# EAGLE schematic CraneCon (EAGLE 9.0.0)
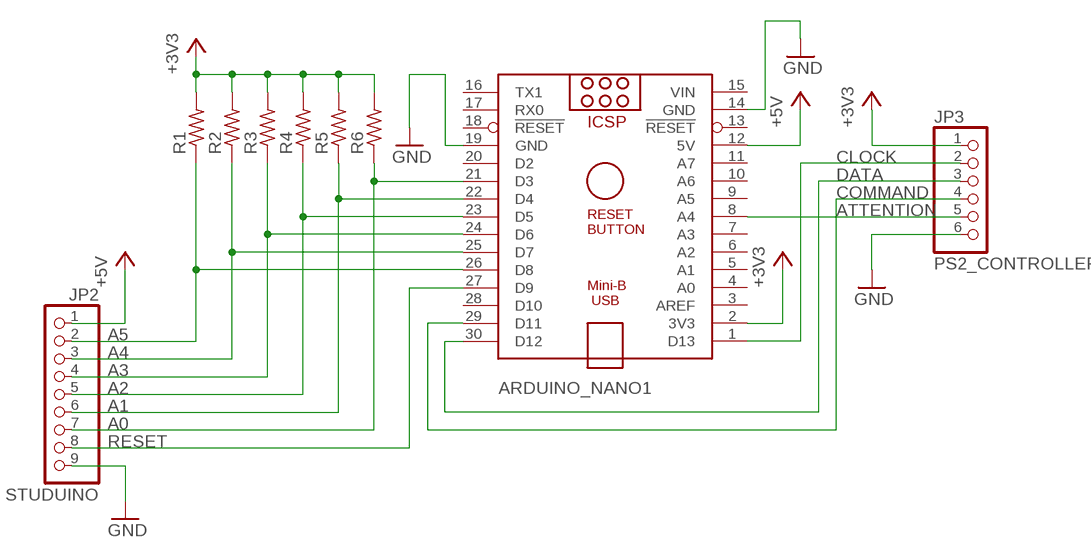
[diagram p0: schematic, sheet 1]

## Parts
ARDUINO_NANO1  ARDUINO_NANO  [ARDUINO_NANO]
JP2  STUDUINO  PINHD-1X9  [1X09]
JP3  PS2_CONTROLLER  PINHD-1X6  [1X06]
R1  R-US_0204/7  [0204/7]
R2  R-US_0204/7  [0204/7]
R3  R-US_0204/7  [0204/7]
R4  R-US_0204/7  [0204/7]
R5  R-US_0204/7  [0204/7]
R6  R-US_0204/7  [0204/7]

## Nets
+3V3: ARDUINO_NANO1.2(3V3) JP3.1 R1.2 R2.2 R3.2 R4.2 R5.2 R6.2
+5V: ARDUINO_NANO1.12(5V) JP2.1
A0: ARDUINO_NANO1.21(D3) JP2.7 R6.1
A1: ARDUINO_NANO1.22(D4) JP2.6 R5.1
A2: ARDUINO_NANO1.23(D5) JP2.5 R4.1
A3: ARDUINO_NANO1.24(D6) JP2.4 R3.1
A4: ARDUINO_NANO1.25(D7) JP2.3 R2.1
A5: ARDUINO_NANO1.26(D8) JP2.2 R1.1
ATTENTION: ARDUINO_NANO1.8(A4) JP3.5
CLOCK: ARDUINO_NANO1.1(D13) JP3.2
COMMAND: ARDUINO_NANO1.29(D11) JP3.4
DATA: ARDUINO_NANO1.30(D12) JP3.3
GND: ARDUINO_NANO1.14(GND) ARDUINO_NANO1.19(GND) JP2.9 JP3.6
RESET: ARDUINO_NANO1.27(D9) JP2.8
Unconnected: ARDUINO_NANO1.3(AREF) ARDUINO_NANO1.4(A0) ARDUINO_NANO1.5(A1) ARDUINO_NANO1.6(A2) ARDUINO_NANO1.7(A3) ARDUINO_NANO1.9(A5) ARDUINO_NANO1.10(A6) ARDUINO_NANO1.11(A7) ARDUINO_NANO1.13(!RESET) ARDUINO_NANO1.16(TX1) ARDUINO_NANO1.17(RX0) ARDUINO_NANO1.18(!RESET) ARDUINO_NANO1.20(D2) ARDUINO_NANO1.28(D10)

## Power pins joined to a net without a drawn wire
VIN: ARDUINO_NANO1.15(VIN)

## Library data of the parts
ARDUINO_NANO1 = ArduinoNanoV30:ARDUINO_NANO: Arduino Nano V3.0 Overview: The Arduino Nano is a small, complete, and breadboard-friendly board based on the ATmega328 (Arduino Nano 3.x) or ATmega168 (Arduino Nano 2.x). It has more or less the same functionality of the Arduino Duemilanove, but in a different package. It lacks only a DC power jack, and works with a Mini-B USB cable instead of a standard one. The Nano was designed and is being produced by Gravitech. Specifications: Microcontroller Atmel ATmega168 or ATmega328 Operating Voltage (logic level) 5 V Input Voltage (recommended) 7-12 V Input Voltage (limits) 6-20 V Digital I/O Pins 14 (of which 6 provide PWM output) Analog Input Pins 8 DC Current per I/O Pin 40 mA Flash Memory 16 KB (ATmega168) or 32 KB (ATmega328) of which 2 KB used by bootloader SRAM 1 KB (ATmega168) or 2 KB (ATmega328) EEPROM 512 bytes (ATmega168) or 1 KB (ATmega328) Clock Speed 16 MHz Dimensions 0.73" x 1.70" Length 45 mm Width 18 mm Weigth 5 g Power: The Arduino Nano can be powered via the Mini-B USB connection, 6-20V unregulated external power supply (pin 30), or 5V regulated external power supply (pin 27). The power source is automatically selected to the highest voltage source. Memory: The ATmega168 has 16 KB of flash memory for storing code (of which 2 KB is used for the bootloader); the ATmega328 has 32 KB, (also with 2 KB used for the bootloader). The ATmega168 has 1 KB of SRAM and 512 bytes of EEPROM (which can be read and written with the EEPROM library); the ATmega328 has 2 KB of SRAM and 1 KB of EEPROM. Input and Output: Each of the 14 digital pins on the Nano can be used as an input or output, using pinMode(), digitalWrite(), and digitalRead() functions. They operate at 5 volts. Each pin can provide or receive a maximum of 40 mA and has an internal pull-up resistor (disconnected by default) of 20-50 kOhms. In addition, some pins have specialized functions. Visit Arduino - ArduinoBoardNano <https://www.arduino.cc/en/Main/ArduinoBoardNano>
JP2 = pinhead:PINHD-1X9: PIN HEADER
JP3 = pinhead:PINHD-1X6: PIN HEADER
R1-R6 = resistor:R-US_: RESISTOR, American symbol